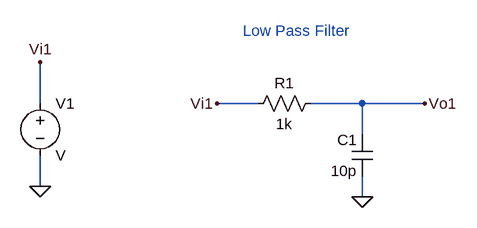
[diagram p0: schematic Low Pass Filter.asc]
Low Pass Filter.asc, the LTspice schematic file:
Version 4
SHEET 1 880 680
WIRE 192 128 192 64
WIRE 528 128 464 128
WIRE 688 128 608 128
WIRE 784 128 688 128
WIRE 688 176 688 128
WIRE 192 256 192 208
WIRE 688 272 688 240
FLAG 464 128 Vi1
FLAG 688 272 0
FLAG 784 128 Vo1
FLAG 192 256 0
FLAG 192 64 Vi1
SYMBOL cap 704 240 R180
WINDOW 0 24 56 Left 2
WINDOW 3 24 8 Left 2
SYMATTR InstName C1
SYMATTR Value 10p
SYMBOL res 512 144 R270
WINDOW 0 32 56 VTop 2
WINDOW 3 0 56 VBottom 2
SYMATTR InstName R1
SYMATTR Value 1k
SYMBOL voltage 192 112 R0
SYMATTR InstName V1
TEXT 504 16 Left 2 ;Low Pass Filter

The netlist it stands for:
* Low Pass Filter.asc
C1 0 Vo1 10p
R1 Vi1 Vo1 1k
V1 Vi1 0 V
* Low Pass Filter
.backanno
.end